# Altium schematic sheet Led_sensor_board_wiring.SchDoc
size A4
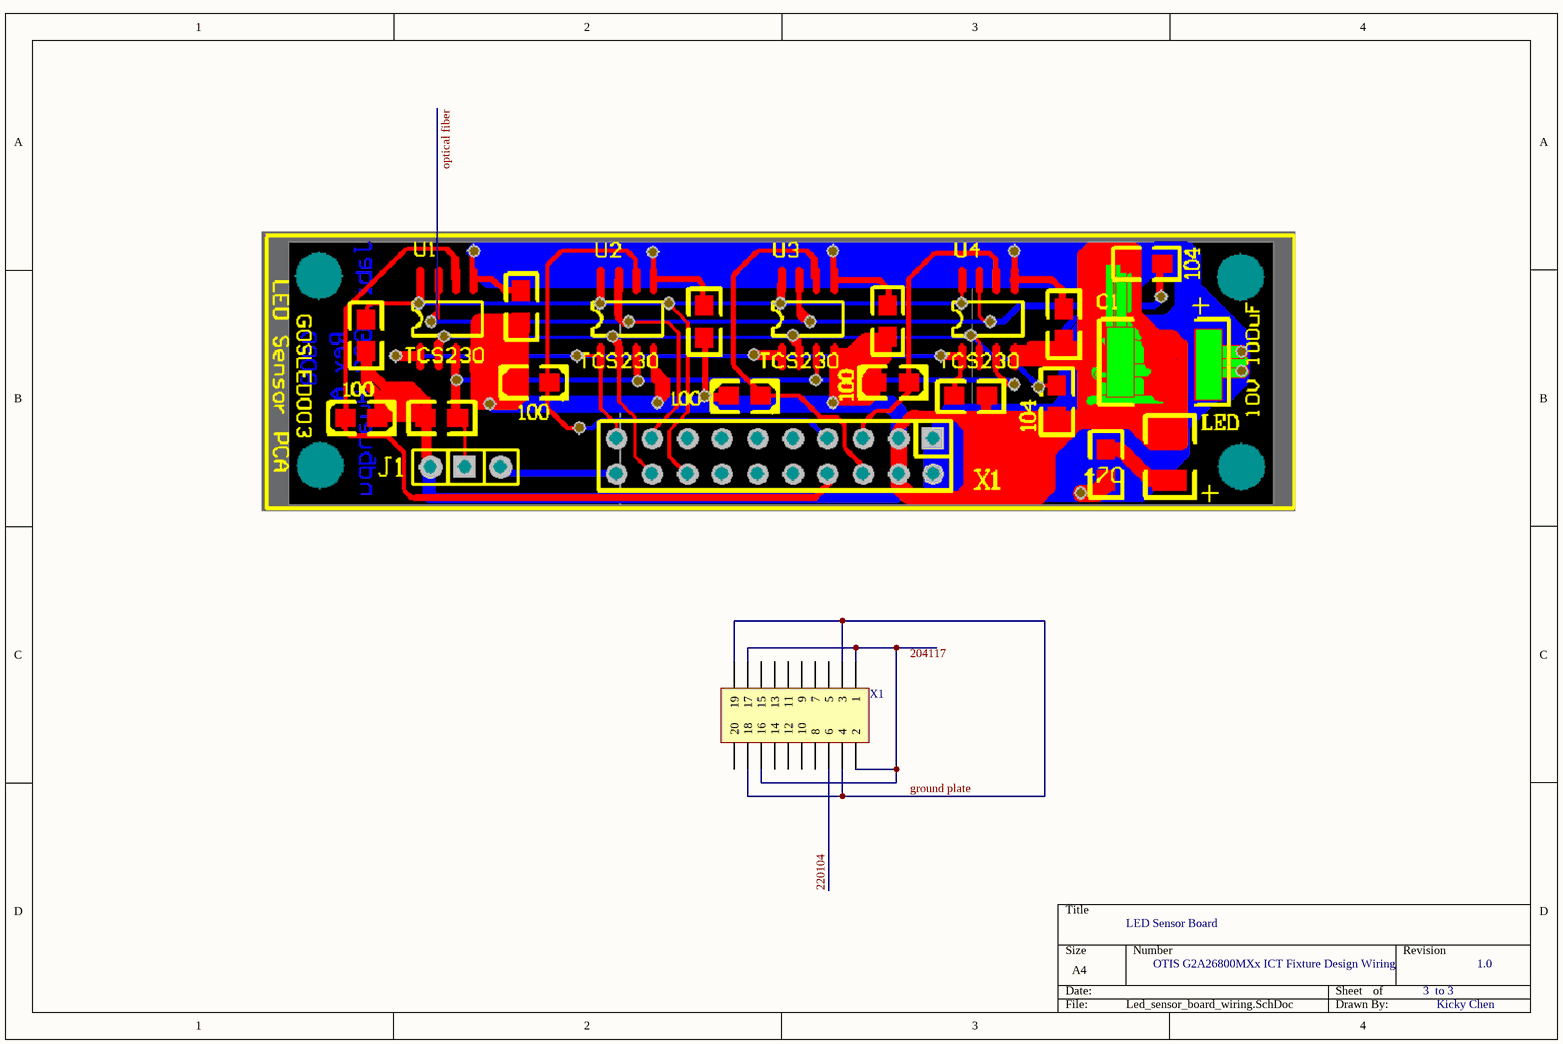
[diagram p0: Led_sensor_board_wiring.SchDoc]

## Parts
X1  Header 10X2  [HDR2X10]  (value not drawn)

## Nets
220104: X1.6
ground plate: X1.3 X1.4 X1.18 X1.19
NetX1_1: X1.1 X1.2 X1.16 X1.17

Not connected (* = marked no-connect by the designer): X1 5 7 8 9 10 11 12 13 14 15 20

## Notes on the sheet
- LED Sensor Board
- OTIS G2A26800MXx ICT Fixture Design Wiring
- 3  to 3
- 1.0
- Kicky Chen
- Labels drawn without touching a wire or pin: 204117

## Library data of the parts
X1 = Header 10X2: Header, 10-Pin, Dual row; LatestRevisionDate: 17-Jul-2002; LatestRevisionNote: Re-released for DXP Platform.; Publisher: Altium Limited